# EAGLE design bbc (EAGLE 9.6.1)
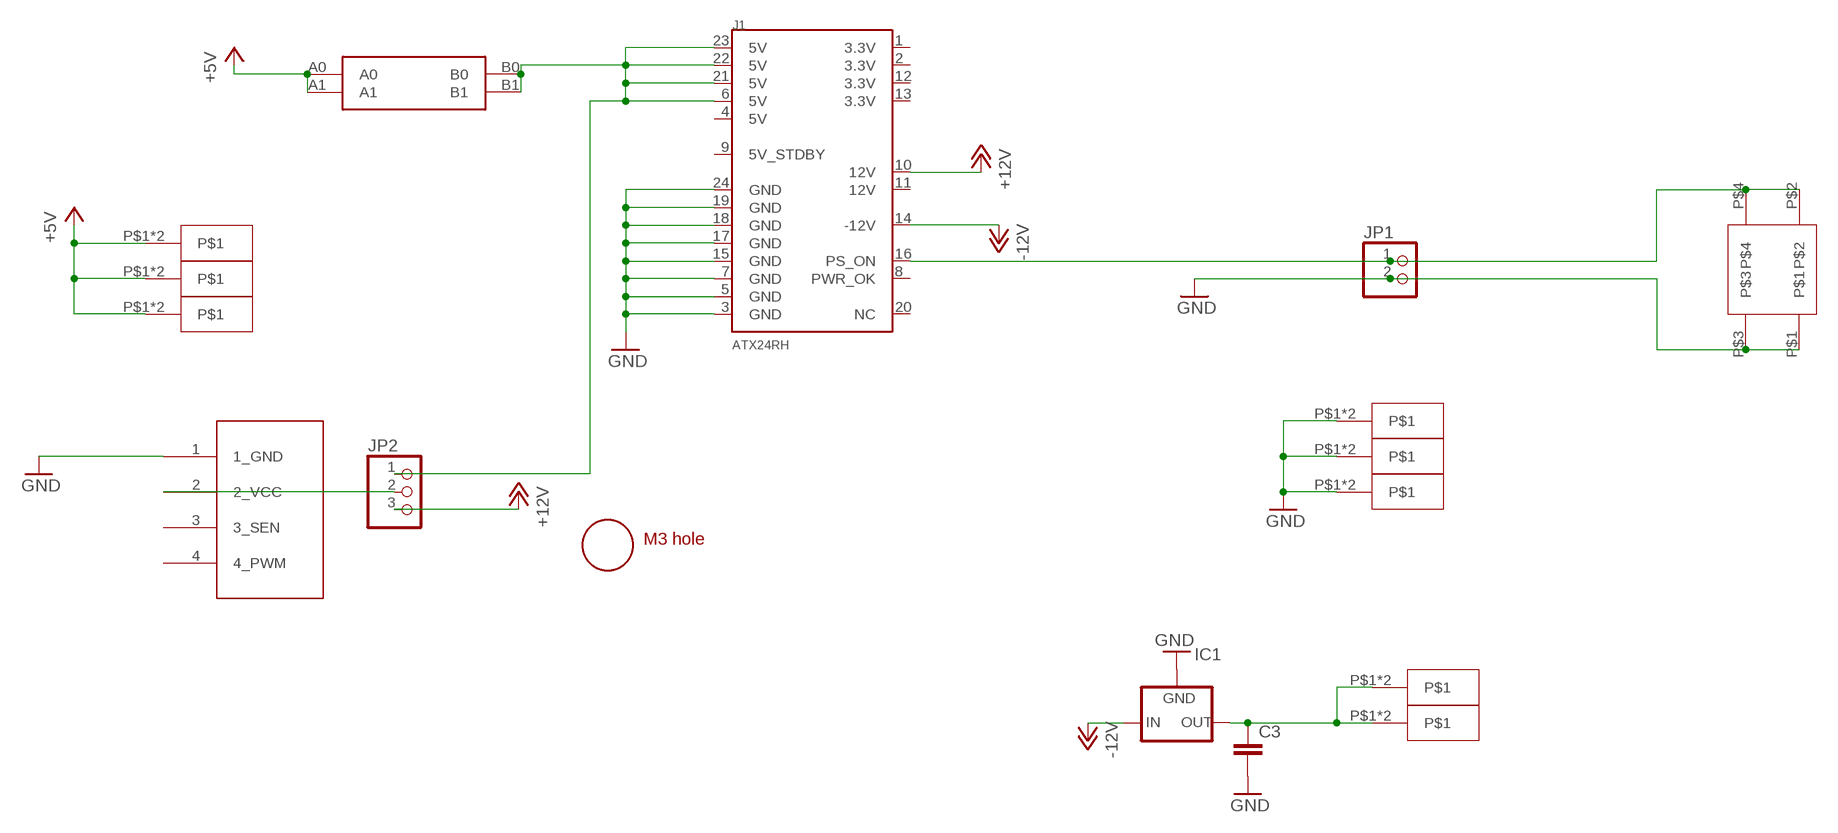
[diagram p0: schematic, sheet 1]

## Parts
C3  C5/2.5  [C5B2.5]
IC1  79XXS  [79XXS]
J1  ATX24RH  [ATX24_RIGHT_ANGLE]
JP1  PINHD-1X2  [1X02]
JP2  PINHD-1X3  [1X03]
JP3  4PIN_FAN  [1X04]
U$1  CAR_FUSE_HOLDER3IN1  [FUSE_HOLDER_3IN1]
U$2  BLADE28  [2.8BLADE]
U$3  ROCK_SW  [ROCK_SWITCH]
U$4  M3_MOUNTING_HOLE  [M3_MOUNTING_HOLE_PACK]
U$5  BLADE28  [2.8BLADE]
U$6  BLADE28  [2.8BLADE]
U$7  BLADE28  [2.8BLADE]
U$8  BLADE28  [2.8BLADE]
U$9  BLADE28  [2.8BLADE]
U$10  BLADE28  [2.8BLADE]
U$11  BLADE28  [2.8BLADE]

## Nets
+5V: U$1.A0 U$1.A1 U$6.P$1 U$6.P$2 U$7.P$1 U$7.P$2 U$8.P$1 U$8.P$2
+12V: J1.10(12V) JP2.3
-12V: IC1.IN J1.14(-12V)
GND: C3.2 IC1.GND J1.3(GND) J1.5(GND) J1.7(GND) J1.15(GND) J1.17(GND) J1.18(GND) J1.19(GND) J1.24(GND) JP1.2 JP3.1(1_GND) U$3.P$1 U$3.P$3 U$9.P$1 U$9.P$2 U$10.P$1 U$10.P$2 U$11.P$1 U$11.P$2
N$1: JP2.2 JP3.2(2_VCC)
N$2: C3.1 IC1.OUT U$2.P$1 U$2.P$2 U$5.P$1 U$5.P$2
N$5: J1.16(PS_ON) JP1.1 U$3.P$2 U$3.P$4
N$6: J1.6(5V) J1.21(5V) J1.22(5V) J1.23(5V) JP2.1 U$1.B0 U$1.B1
Unconnected: J1.1(3.3V) J1.2(3.3V) J1.4(5V) J1.8(PWR_OK) J1.9(5V_STDBY) J1.11(12V) J1.12(3.3V) J1.13(3.3V) J1.20(NC) JP3.3(3_SEN) JP3.4(4_PWM)

## Library data of the parts
C3 = capacitor-wima:C: CAPACITOR naming: grid - package width
IC1 = v-reg:79XXS: VOLTAGE REGULATOR
J1 = macse:ATX24: ATX24 Pin Power Supply Connector This is a good connector for connecting a computer power supply to a PCB. It's massive, but provides many amps of power at 5V and 12V. SKU: PRT-09498
JP1 = pinhead:PINHD-1X2: PIN HEADER
JP2 = pinhead:PINHD-1X3: PIN HEADER
JP3 = appleii:4PIN_FAN: PIN HEADER
U$1 = atx_power_control:CAR_FUSE_HOLDER
U$2 U$5-U$11 = blade:BLADE28
U$3 = atx4vc:ROCK_SW
U$4 = a:M3_MOUNTING_HOLE

## Board
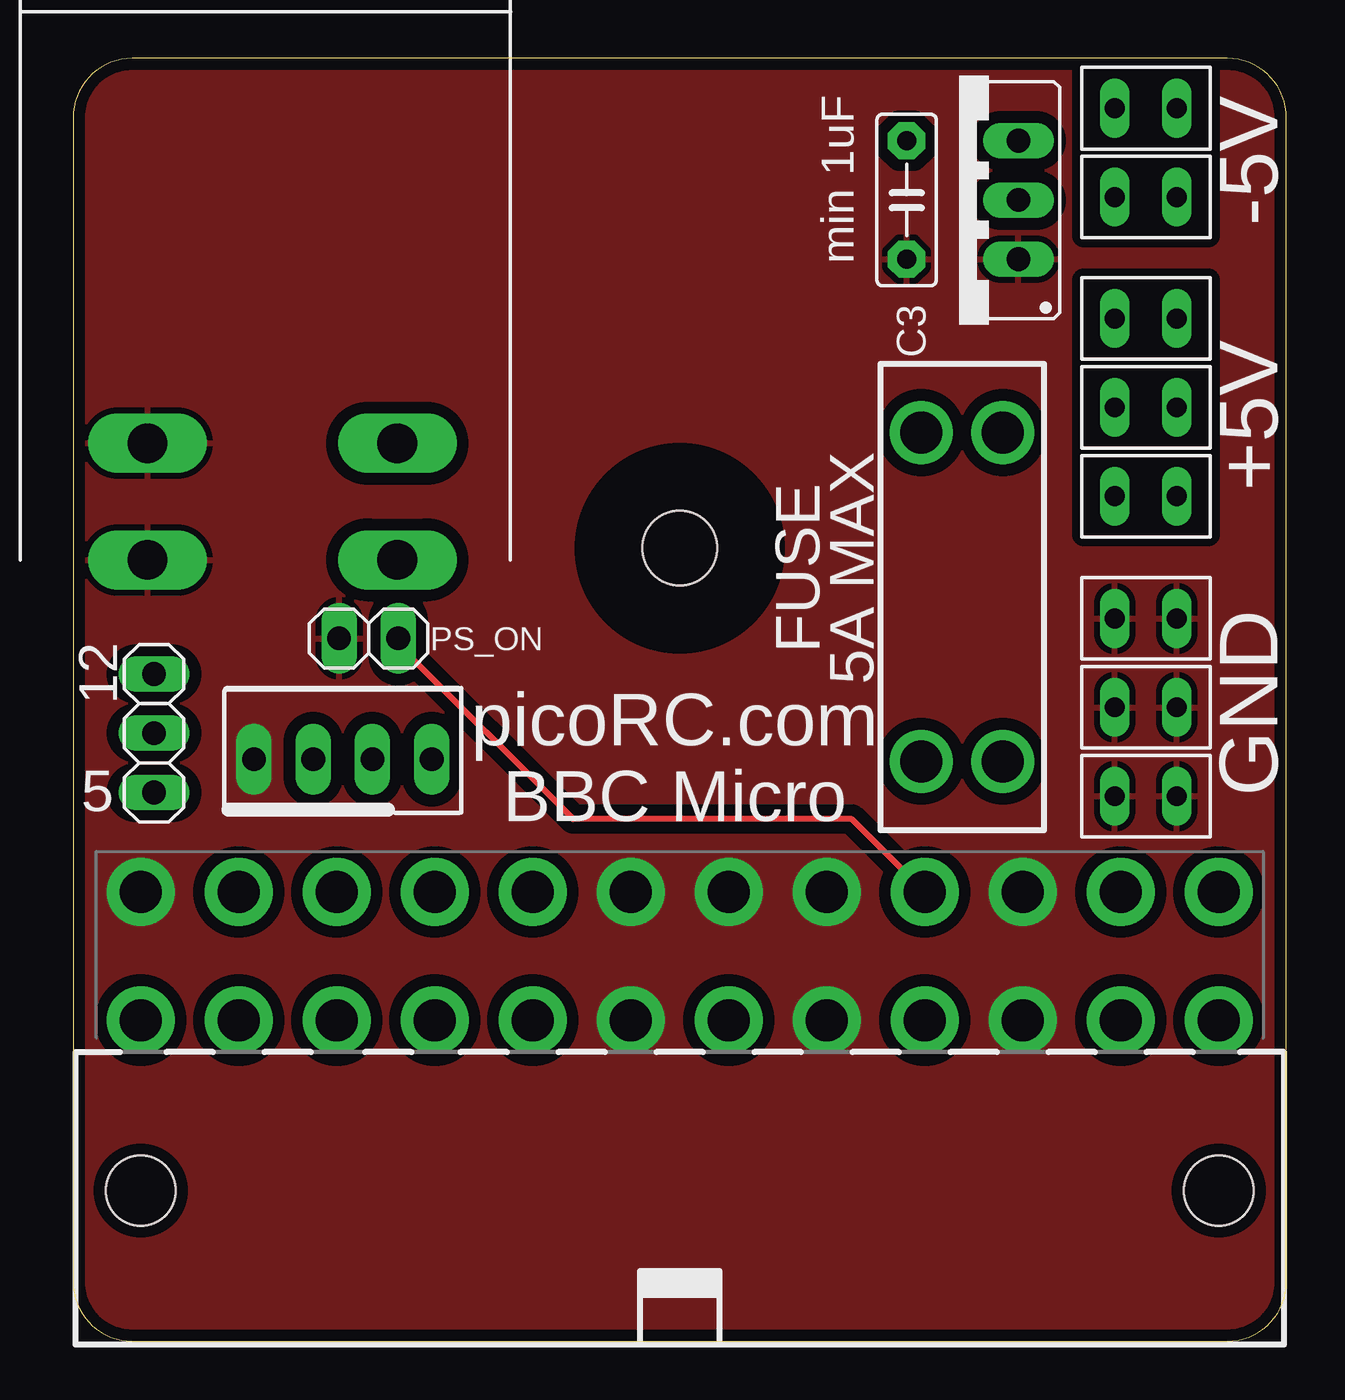
[diagram p1: board, top side]
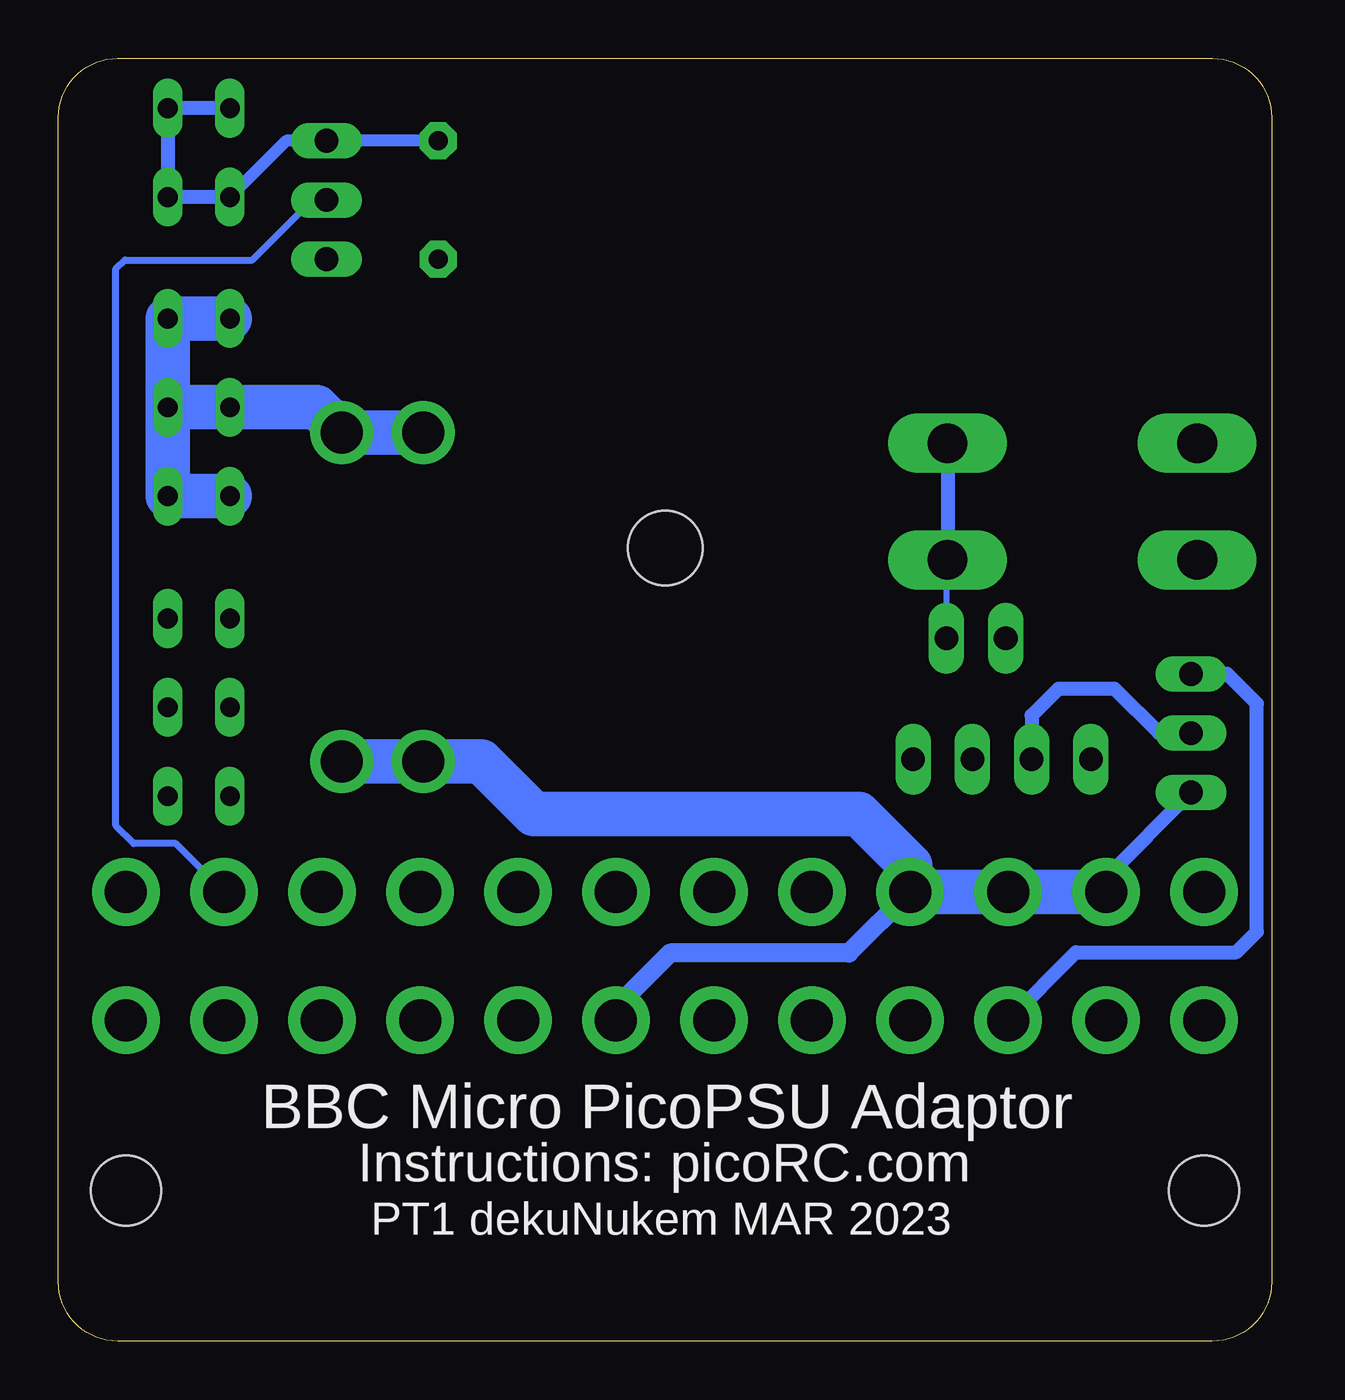
[diagram p2: board, bottom side, seen from below]

Size 52 x 55 mm. Coordinates in mm from the lower left corner, seen from the top.
Outline: 2.54,0 49.46,0 arc90 52,2.54 52,52.46 arc90 49.46,55 2.54,55 arc90 0,52.46 0,2.54 arc90 2.54,0
Copper layers (1*16): Top 0.035mm / dielectric 1.5mm / Bottom 0.035mm
Design rules "deku_2layer_6mil *": minimum track width 6mil, minimum drill 15mil, track to track 20mil, track to pad 6mil, pad to pad 6mil, via to via 6mil, smd to smd 6mil, copper to edge 10mil, drill to drill 6mil, minimum pad ring 7mil, minimum via ring 7mil, stop-mask expansion 4mil, vias tented up to drill 25mil, thermal gap 10mil
tRestrict: area 22,30 to 30,38; area 43.3,34.6 to 48.6,45.5; area 43.3,47.4 to 48.6,54.5

### Footprints (pad centres in the part's own frame; a part is rotated, then mirrored left to right if it is on the bottom)
C5B2.5 = drill 0.813 pad 1.6 octagon: 1 -2.54,0; 2 2.54,0
79XXS = drill 1.016 long: GND -2.54,-2.54; IN 0,-2.54; OUT 2.54,-2.54
ATX24_RIGHT_ANGLE = drill 1.8 pad 2.9: 1 23.1,4.76; 2 18.9,4.76; 3 14.7,4.76; 4 10.5,4.76; 5 6.3,4.76; 6 2.1,4.76; 7 -2.1,4.76; 8 -6.3,4.76; 9 -10.5,4.76; 10 -14.7,4.76; 11 -18.9,4.76; 12 -23.1,4.76; 13 23.1,10.26; 14 18.9,10.26; 15 14.7,10.26; 16 10.5,10.26; 17 6.3,10.26; 18 2.1,10.26; 19 -2.1,10.26; 20 -6.3,10.26; 21 -10.5,10.26; 22 -14.7,10.26; 23 -18.9,10.26; 24 -23.1,10.26 | hole 3: -23.1,-2.54; 23.1,-2.54
1X02 = drill 1.016 long: 1 -1.27,0; 2 1.27,0
1X03 = drill 1.016 long: 1 -2.54,0; 2 0,0; 3 2.54,0
1X04 = drill 1.016 long: 1 -3.81,0; 2 -1.27,0; 3 1.27,0; 4 3.81,0
FUSE_HOLDER_3IN1 = drill 1.8: A0 -7.05,1.75; A1 -7.05,-1.75; B0 7.05,1.75; B1 7.05,-1.75
2.8BLADE = drill 0.85 long: P$1 -1.33,0; P$2 1.33,0
ROCK_SWITCH = drill 1.7 long: P$1 -5.05,0; P$2 5.65,0; P$3 -5.05,5; P$4 5.65,5
M3_MOUNTING_HOLE_PACK = hole 3.2: 0,0

### Placement (x,y rotation side)
C3  35.72,48.93 270 top
IC1  37.97,48.93 90 top
J1  26,9 0 top
JP1  12.67,30.13 180 top
JP2  3.46,26.07 90 top
JP3  11.56,24.95 0 top
U$1  38.1,31.91 270 top
U$2  45.97,49.05 0 top
U$3  8.24,33.49 0 top
U$4  26,34 0 top
U$5  45.97,52.86 0 top
U$6  45.97,43.85 0 top
U$7  45.97,40.04 0 top
U$8  45.97,36.23 0 top
U$9  45.97,30.99 0 top
U$10  45.97,27.18 0 top
U$11  45.97,23.37 0 top

### Tracks (layer width: path | path; a pad name or v marks a point on that pad's centre or on a via)
+5V
  Bottom 1.905: U$1.A1 U$1.A0 40.93,40.04 U$7.P$1 U$7.P$2 | U$6.P$1 U$6.P$2 U$7.P$2 | U$8.P$1 U$8.P$2 U$7.P$2
+12V
  Bottom 0.61: J1.10 8.39,16.67 1.52,16.67 0.64,17.56 0.64,27.34 1.91,28.61 JP2.3
-12V
  Bottom 0.305: J1.14 46.98,21.34 48.77,21.34 49.53,22.1 49.53,45.97 49.15,46.35 43.69,46.35 41.12,48.93 IC1.IN
GND
  pour Top (isolate 0.508): 52,55 0,55 0,-0.06 52,-0.02
N$1
  Bottom 0.61: JP2.2 4.83,26.07 6.73,27.97 9.14,27.97 10.29,26.83 JP3.2
N$2
  Bottom 0.508: C3.1 IC1.OUT 42.23,51.47 U$2.P$1
  Bottom 0.61: U$2.P$1 U$2.P$2 U$5.P$2 U$5.P$1
N$5
  Top 0.254: J1.16 33.38,22.38 21.43,22.38 13.94,29.88 JP1.1
  Bottom 0.254: U$3.P$2 13.94,33.45 JP1.1
  Bottom 0.61: U$3.P$4 U$3.P$2
N$6
  Bottom 0.61: J1.23 7.1,19.89 JP2.1
  Bottom 0.813: J1.21 18.12,16.64 25.78,16.64 28.1,14.32 J1.6
  Bottom 1.905: J1.23 J1.22 J1.21 15.5,20.4 17.7,22.61 31.62,22.61 33.87,24.86 U$1.B1 U$1.B0

### Text on the board
tNames: -5V | min 1uF | +5V | FUSE / 5A MAX | PS_ON | 12 | picoRC.com | GND | 5 | BBC Micro
bNames: BBC Micro PicoPSU Adaptor | Instructions: picoRC.com | PT1 dekuNukem MAR 2023